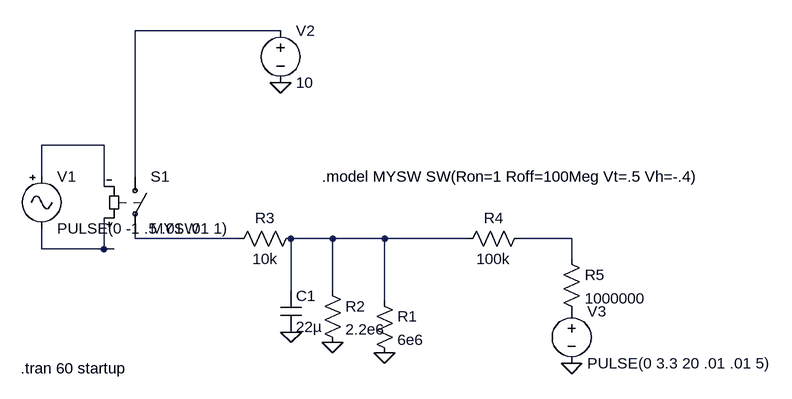
[diagram p0: schematic Draft3.asc]
Draft3.asc, the LTspice schematic file:
Version 4
SHEET 1 880 680
WIRE 64 -272 -160 -272
WIRE -208 -96 -304 -96
WIRE -304 -48 -304 -96
WIRE -160 -48 -160 -272
WIRE -208 -32 -208 -96
WIRE -160 48 -160 32
WIRE 0 48 -160 48
WIRE 144 48 80 48
WIRE 224 48 144 48
WIRE 352 48 224 48
WIRE 512 48 432 48
WIRE -304 64 -304 32
WIRE -208 64 -208 16
WIRE -208 64 -304 64
WIRE -192 64 -208 64
WIRE 512 80 512 48
WIRE 80 128 80 48
WIRE 144 128 144 48
WIRE 224 144 224 48
FLAG 224 224 0
FLAG 144 208 0
FLAG 80 192 0
FLAG 64 -192 0
FLAG 512 240 0
SYMBOL res 208 128 R0
SYMATTR InstName R1
SYMATTR Value 6e6
SYMBOL sw -160 -64 R0
SYMATTR InstName S1
SYMATTR Value MYSW
SYMBOL Misc\\signal -304 -64 R0
WINDOW 123 0 0 Left 0
WINDOW 39 0 0 Left 0
SYMATTR InstName V1
SYMATTR Value PULSE(0 -1 .5 .01 .01 1)
SYMBOL cap 64 128 R0
SYMATTR InstName C1
SYMATTR Value 22µ
SYMBOL res 128 112 R0
SYMATTR InstName R2
SYMATTR Value 2.2e6
SYMBOL voltage 64 -288 R0
WINDOW 123 0 0 Left 0
WINDOW 39 0 0 Left 0
SYMATTR InstName V2
SYMATTR Value 10
SYMBOL res 96 32 R90
WINDOW 0 0 56 VBottom 2
WINDOW 3 32 56 VTop 2
SYMATTR InstName R3
SYMATTR Value 10k
SYMBOL res 448 32 R90
WINDOW 0 0 56 VBottom 2
WINDOW 3 32 56 VTop 2
SYMATTR InstName R4
SYMATTR Value 100k
SYMBOL res 496 64 R0
SYMATTR InstName R5
SYMATTR Value 1000000
SYMBOL voltage 512 144 R0
WINDOW 123 0 0 Left 0
WINDOW 39 0 0 Left 0
SYMATTR InstName V3
SYMATTR Value PULSE(0 3.3 20 .01 .01 5)
TEXT -336 248 Left 2 !.tran 60 startup
TEXT 128 -48 Left 2 !.model MYSW SW(Ron=1 Roff=100Meg Vt=.5 Vh=-.4)

The netlist it stands for:
* Draft3.asc
R1 N004 0 6e6
S1 N001 N003 N006 N002 MYSW
V1 N002 N006 PULSE(0 -1 .5 .01 .01 1)
C1 N004 0 22µ
R2 N004 0 2.2e6
V2 N001 0 10
R3 N004 N003 10k
R4 N005 N004 100k
R5 N005 P001 1000000
V3 P001 0 PULSE(0 3.3 20 .01 .01 5)
.tran 60 startup
.model MYSW SW(Ron=1 Roff=100Meg Vt=.5 Vh=-.4)
.backanno
.end